# Altium schematic sheet Peripherals.SchDoc
size A4; SheetNumber: 4; SheetTotal: 4
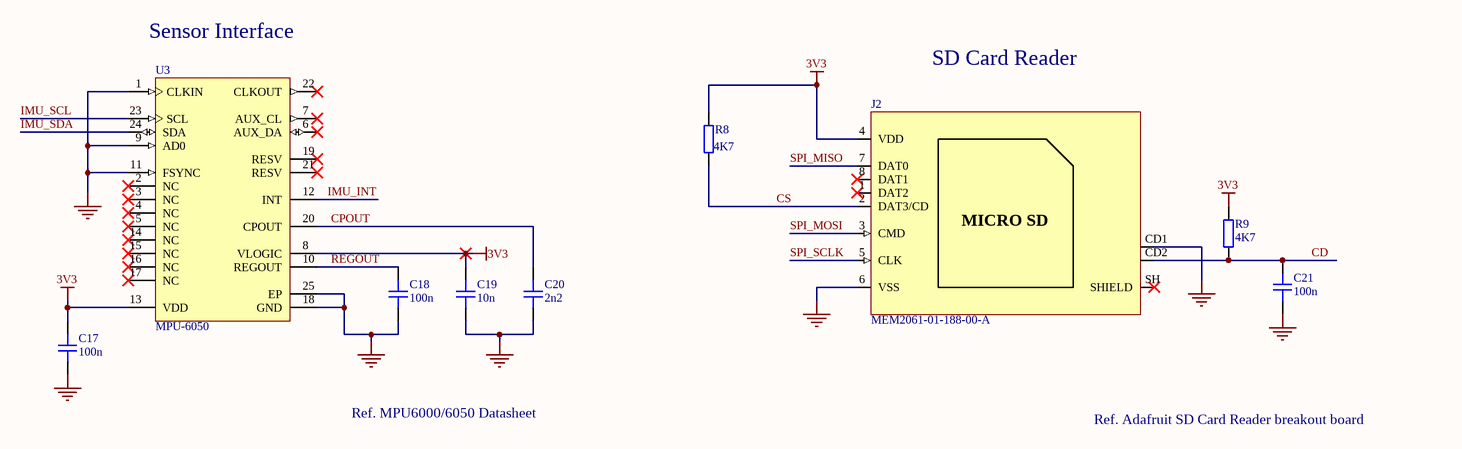
[diagram p0: Peripherals.SchDoc]

## Parts
C17  100n  [CAP_0402]
C18  100n  [CAP_0402]
C19  10n  [CAP_0402]
C20  2n2  [CAP_0402]
C21  100n  [CAP_0402]
J2  MEM2061-01-188-00-A  [MEM2061-01-188-00-A]
R8  4K7  [RES_0402]
R9  4K7  [RES_0402]
U3  MPU-6050  [IS-QFN-24_V]

## Nets
3V3: C17.2 C19.2 J2.4(VDD) R8.2 R9.2 U3.8(VLOGIC) U3.13(VDD)
GND: C17.1 C18.1 C19.1 C20.1 C21.1 J2.6(VSS) J2.CD1(CARD_DETECT) U3.1(CLKIN) U3.9(AD0) U3.11(FSYNC) U3.18(GND) U3.25(EP)
CD: C21.2 J2.CD2(CARD_DETECT) R9.1
CPOUT: C20.2 U3.20(CPOUT)
CS: J2.2(DAT3/CD) R8.1
IMU_INT: U3.12(INT)
IMU_SCL: U3.23(SCL)
IMU_SDA: U3.24(SDA)
REGOUT: C18.2 U3.10(REGOUT)
SPI_MISO: J2.7(DAT0)
SPI_MOSI: J2.3(CMD)
SPI_SCLK: J2.5(CLK)

Not connected (* = marked no-connect by the designer): J2 1(DAT2)* 8(DAT1)* SH(SHIELD)*; U3 2(NC)* 3(NC)* 4(NC)* 5(NC)* 6(AUX_DA)* 7(AUX_CL)* 14(NC)* 15(NC)* 16(NC)* 17(NC)* 19(RESV)* 21(RESV)* 22(CLKOUT)*

## Notes on the sheet
- (near U3) Sensor Interface
- SD Card Reader
- Ref. MPU6000/6050 Datasheet
- Ref. Adafruit SD Card Reader breakout board
- (in symbol MEM2061-01-188-00-A) MICRO SD

## Library data of the parts
C17-C21 = CAP_0402: Capacitor SMD 0402; Manufacturer: *; Manufacturer Part Number: *; Distributor Link: *; LCSC: *; Rating: *; Dielectric: *
J2 = MEM2061-01-188-00-A: Micro SD Card Holder Push-Push SMD; Manufacturer: GCT; Manufacturer Part Number: MEM2061-01-188-00-A; Distributor Link: *; LCSC: *
R8 R9 = RES_0402: Resistor SMD 0402; Manufacturer: *; Manufacturer Part Number: *; Distributor Link: *; LCSC: *
U3 = CMP-1753-00002-2: 3-Axis Gyroscope, Accelerometer and a Digital Motion Processor(TM) (DMP), 2.375 to 3.46 V, -40 to 85 degC, 24-Pin QFN, RoHS, Tape and Reel; Manufacturer: InvenSense; Featured Product: MPU-60506-Axis,IntegratedI²CSolution; Other Names: 1428-1007-2 / MPU6050; Sensor Type: MotionTracking; Online Catalog: MPU-6000™Series; Unit PriceUSD: Digital; Datasheet Version: Rev. 3.3, 05/2012; Category: Sensors,Transducers; Datasheet URL: http://datasheet.octopart.com/MPU-6050-InvenSense-datasheet-14421344.pdf; Family: Multifunction; Standard Package: 5,000; Manufacturer URL: http://www.invensense.com/; Output Type: Digital; Dynamic Catalog: MPU-6000™Series